# Altium schematic sheet Преобразователь интерфейсов.SchDoc
size 420 x 297 mm; DocumentNumber: СКТБ.421455.001; SheetNumber: 2; Format: A3
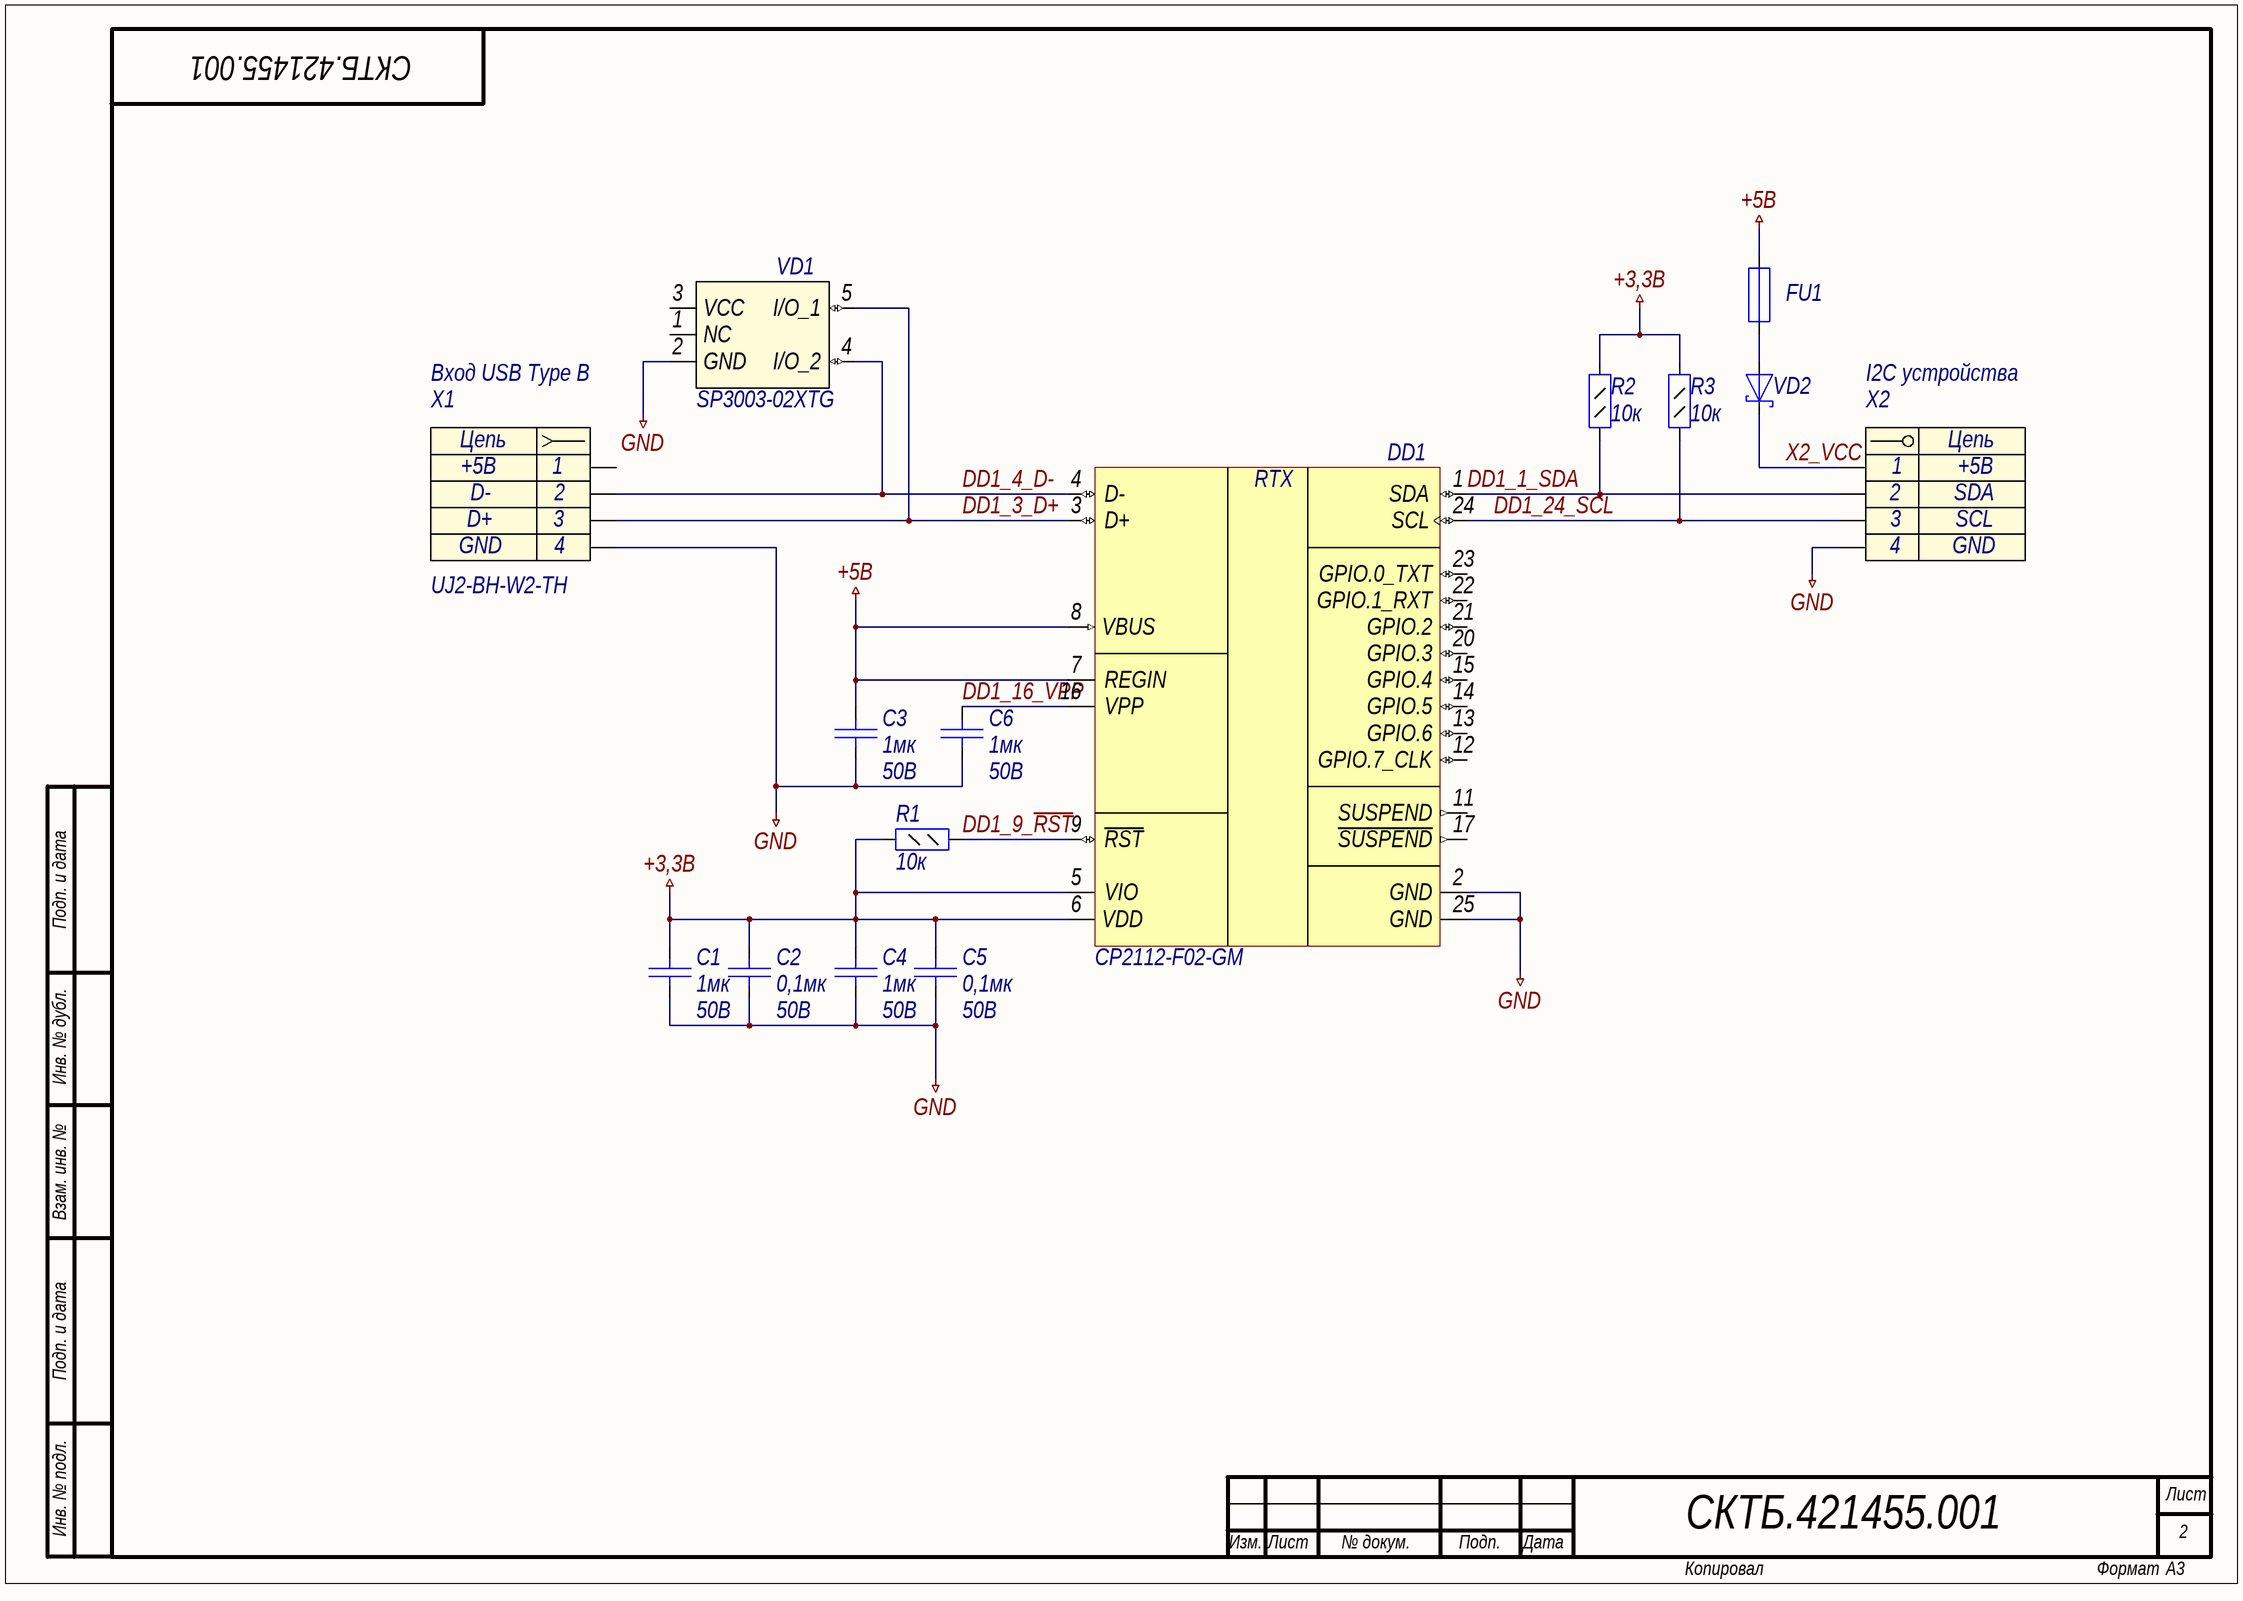
[diagram p0: Преобразователь интерфейсов.SchDoc]

## Parts
C1  value 1мк  Voltage: 50B  [C0603]  (hidden comment: Capacitor)
C2  value 0,1мк  Voltage: 50B  [C0603]  (hidden comment: Capacitor)
C3  value 1мк  Voltage: 50B  [C0603]  (hidden comment: Capacitor)
C4  value 1мк  Voltage: 50B  [C0603]  (hidden comment: Capacitor)
C5  value 0,1мк  Voltage: 50B  [C0603]  (hidden comment: Capacitor)
C6  value 1мк  Voltage: 50B  [C0603]  (hidden comment: Capacitor)
DD1  CP2112-F02-GM  [QFN24]
FU1  Fuse  [FUSE812]  (value not drawn)
R1  value 10к  [R0805]  (hidden comment: Resistor_0,125Вт)
R2  value 10к  [R0805]  (hidden comment: Resistor_0,125Вт)
R3  value 10к  [R0805]  (hidden comment: Resistor_0,125Вт)
VD1  SP3003-02XTG  [SOT553]
VD2  DiodeSchottky  [SMA]  (value not drawn)
X1  Вход USB Type B  Part Number: UJ2-BH-W2-TH  [USB-B RECEPTACLE]
X2  I2C устройства  [TERMINAL 4 way-5mm]

## Nets
+3,3В: C1.2 C2.2 C4.2 C5.2 DD1.5(VIO) DD1.6(VDD) R1.2 R2.2 R3.2
+5В: C3.2 DD1.7(REGIN) DD1.8(VBUS) FU1.2
GND: C1.1 C2.1 C3.1 C4.1 C5.1 C6.1 DD1.2(GND) DD1.25(GND) VD1.2(GND) X1.4 X2.4
DD1_1_SDA: DD1.1(SDA) R2.1 X2.2
DD1_3_D+: DD1.3(D+) VD1.5(I/O_1) X1.3
DD1_4_D-: DD1.4(D-) VD1.4(I/O_2) X1.2
DD1_9_~{RST}: DD1.9(~{RST}) R1.1
DD1_16_VPP: C6.2 DD1.16(VPP)
DD1_24_SCL: DD1.24(SCL) R3.1 X2.3
X2_VCC: VD2.1(K) X2.1
NetFU1_1: FU1.1 VD2.2(A)

Not connected (* = marked no-connect by the designer): DD1 11(SUSPEND) 12(GPIO.7_CLK) 13(GPIO.6) 14(GPIO.5) 15(GPIO.4) 17(~{SUSPEND}) 20(GPIO.3) 21(GPIO.2) 22(GPIO.1_RXT) 23(GPIO.0_TXT); VD1 1(NC) 3(VCC); X1 1

## Notes on the sheet
- Подп. и дата
- Инв. № дубл.
- Взам. инв. №
- Инв. № подл.
- Лист
- Изм.
- № докум.
- Подп.
- Дата
- Копировал
- Формат
- (in symbol connect24) Цепь
- (in symbol connect39) Цепь
- (in symbol interf14) RTX

## Library data of the parts
C1 C3 C4 C6 = cap134: Конденсатор; Part Name: Capacitors; Part Number: GRM188R71C105KA12D**; id: cap134; TKE: X7R
C2 C5 = cap131: Конденсатор; Part Name: Capacitors; Part Number: GRM188R71H104K; id: cap131; TKE: X7R
DD1 = interf14: USB-I2C преобразователь; Part Name: HID USB to SMBUS Bridge; Manufacture: Silicon Laboratories; Vref output: 3.45V; Type Supply: Single Polar; Current Consumption: 15mA; Power Supply: 3.0-3.6V; id: interf14; Part Number: CP2112-F02-GM
FU1 = fuse20: Предохранитель; Part Name: Resettable Fuses; Manufacture: Bourns; Part Number: MF-USMF005-2; id: fuse20; V max: 30B; I max: 10A; I hold: 0,05A; I trip: 0,15A; Resistance: 2,8Ohms
R1-R3 = res97: Резистор; Manufacture: Yageo; Part Number: RC0805FR-0710KL; id: res97; Accuracy: 1%; Part Name: Resistor; Power: 0,125Вт
VD1 = diode14: Двухканальная ESD защита USB; Part Name: ESD Suppression Diodes for USB; Manufacture: Littelfuse; Reverse Voltage: 6В; Leakage current: 0,5uA; Capacitance: 0,65pF; Number of Channels: 2; id: diode14; Breakdown Voltage: 6В; Part Number: SP3003-02XTG
VD2 = diode2: Диод Шоттки; Part Number: SK34A; Manufacture: Taiwan Semiconductor; id: diode2; Reverse Voltage: 40B; Forward Voltage: 0,55B; Forward Current: 3A; Part Name: Diode Schottky
X1 = connect39: Разъем - 4 конт. розетка; Part Name: USB Type B 2.0 Receptacle; Manufacture: CUI; Contact_1: +5В; Contact_2: D-; Contact_3: D+; Contact_4: GND; id: connect39
X2 = connect24: Разъем - 4 конт. клеммник; Part Name: TERMINAL BLOCK 4 way; Contact_1: +5В; Contact_2: SDA; Contact_3: SCL; Contact_4: GND; Etch: 5mm; id: connect24